# EAGLE schematic Helder ll - Placa Redundante.V5_ v1_ (EAGLE 9.7.0)
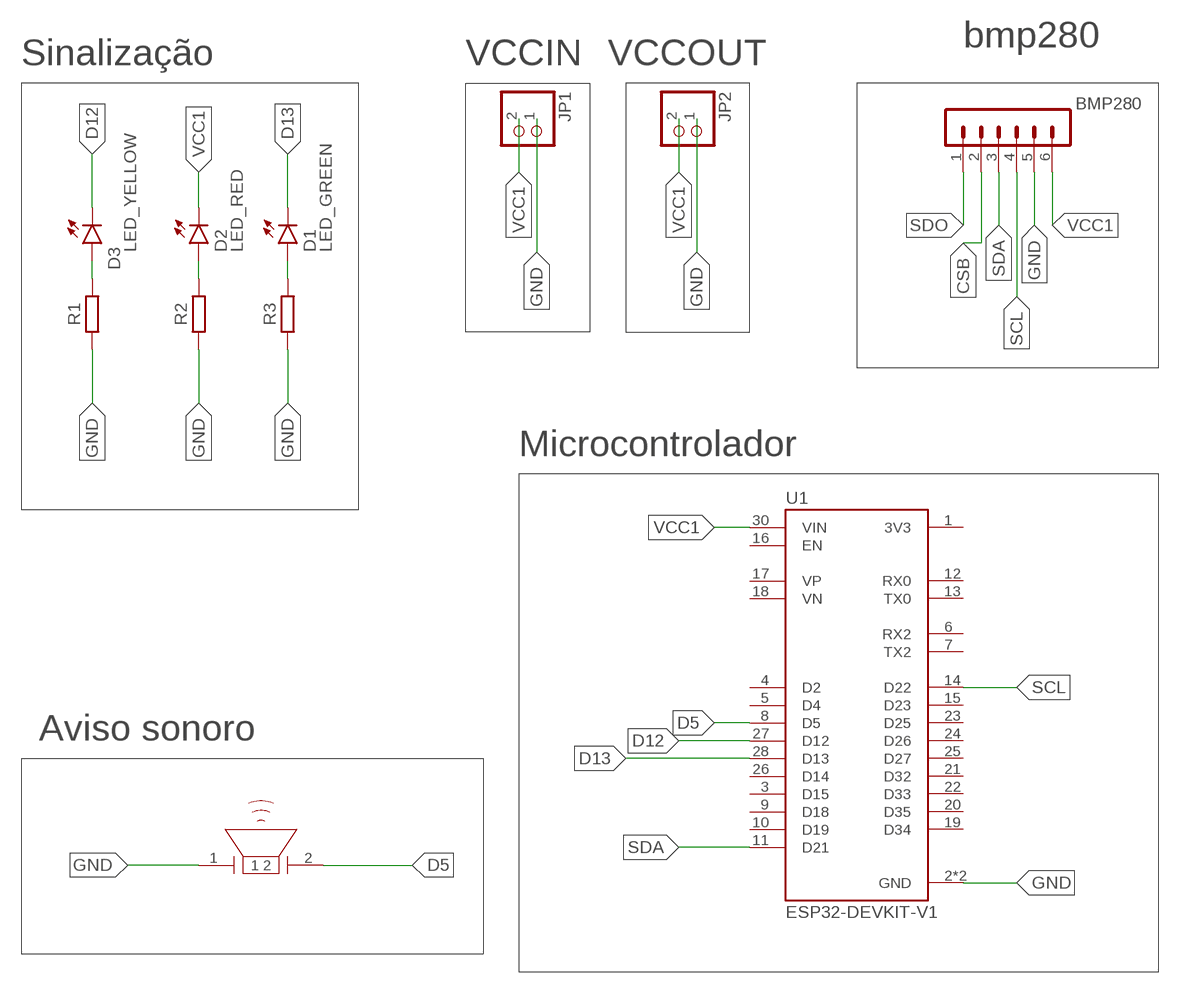
[diagram p0: schematic, sheet 1]

## Parts
BMP280  MA06-1  [MA06-1]
D1  LED_GREEN  LED_RADIAL_GREEN  [LEDRD254W60D565H860B_G]
D2  LED_RED  LED_RADIAL_RED  [LEDRD254W60D565H860B]
D3  LED_YELLOW  LED_RADIAL_YELLOW  [LEDRD254W60D565H860B_Y]
JP1  PINHD-1X2/90  [1X02/90]
JP2  PINHD-1X2/90  [1X02/90]
LS1  PIEZO  [PIEZO]
R1  R_AXIAL-7.2MM-PITCH  [RESAD724W46L381D178B]
R2  R_AXIAL-7.2MM-PITCH  [RESAD724W46L381D178B]
R3  R_AXIAL-7.2MM-PITCH  [RESAD724W46L381D178B]
U1  ESP32-DEVKIT-V1  [MODULE_ESP32_DEVKIT_V1]

## Nets
CSB: BMP280.2
D5: LS1.2 U1.8(D5)
D12: D3.2(C) U1.27(D12)
D13: D1.2(C) U1.28(D13)
GND: BMP280.5 JP1.1 JP2.1 LS1.1 R1.1 R2.1 R3.1 U1.2(GND) U1.29(GND)
N$1: D1.1(A) R3.2
N$2: D2.1(A) R2.2
N$3: D3.1(A) R1.2
SCL: BMP280.4 U1.14(D22)
SDA: BMP280.3 U1.11(D21)
SDO: BMP280.1
VCC1: BMP280.6 D2.2(C) JP1.2 JP2.2 U1.30(VIN)
Unconnected: U1.1(3V3) U1.3(D15) U1.4(D2) U1.5(D4) U1.6(RX2) U1.7(TX2) U1.9(D18) U1.10(D19) U1.12(RX0) U1.13(TX0) U1.15(D23) U1.16(EN) U1.17(VP) U1.18(VN) U1.19(D34) U1.20(D35) U1.21(D32) U1.22(D33) U1.23(D25) U1.24(D26) U1.25(D27) U1.26(D14)

## Notes on the sheet
- bmp280
- Sinalização | VCCIN | VCCOUT
- Microcontrolador
- Aviso sonoro

## Library data of the parts
BMP280 = con-lstb:MA06-1: PIN HEADER; OC_FARNELL: unknown; OC_NEWARK: unknown
D1-D3 = Tinkercad:LED_RADIAL: LED - Generic; CATEGORY: Opto-Electronic; SUB-CATEGORY: LED
JP1 JP2 = pinhead:PINHD-1X2: PIN HEADER
LS1 = Tinkercad:PIEZO: Piezoelectric Sounders / Buzzers Reference Datasheet <https://www.murata.com/products/productdata/8801054621726/SPEC-PKM17EPPH4001-B0.pdf?1517839212000>
R1-R3 = Resistor:R: Resistor Fixed - Generic; CATEGORY: Resistor; SUB-CATEGORY: Fixed
U1 = ESP32-DEVKIT-V1:ESP32-DEVKIT-V1: Dual core, Wi-Fi: 2.4 GHz up to 150 Mbits/s,BLE (Bluetooth Low Energy) and legacy Bluetooth, 32 bits, Up to 240 MHz Check availability <https://pricing.snapeda.com/parts/ESP32-DEVKIT-V1/Do%20it/view-part?ref=eda>; AVAILABILITY: Not in stock; CHECK_PRICES: https://www.snapeda.com/parts/ESP32-DEVKIT-V1/Do+it/view-part/?ref=eda; DESCRIPTION: Dual core, Wi-Fi: 2.4 GHz up to 150 Mbits/s,BLE (Bluetooth Low Energy) and legacy Bluetooth, 32 bits, Up to 240 MHz; MF: Do it; MP: ESP32-DEVKIT-V1; PACKAGE: None; PRICE: None; SNAPEDA_LINK: https://www.snapeda.com/parts/ESP32-DEVKIT-V1/Do+it/view-part/?ref=snap